# Altium project ARM_V2.PrjPcb (part 1 of 2)
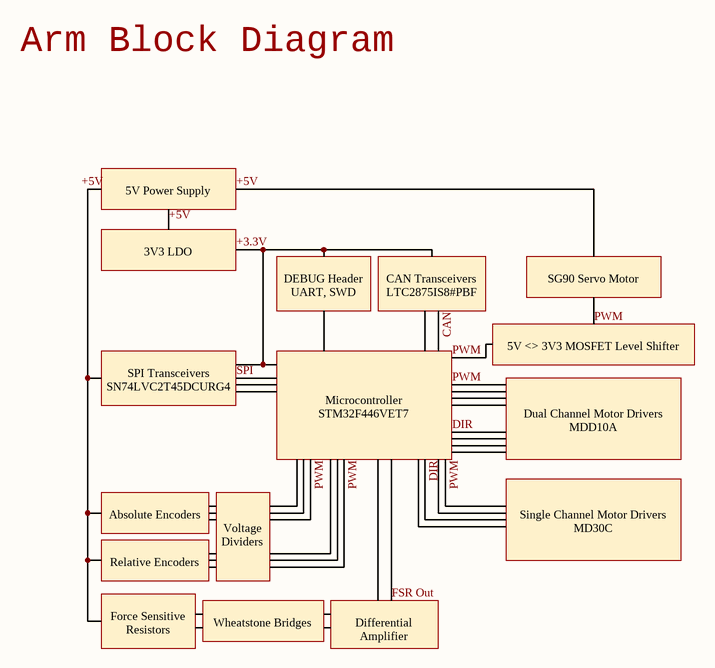
[diagram p0: Block Diagram.SchDoc]
BoardName: Arm_Rev2
9 sheets, 172 parts. Net scope: flat (ports and power ports of the same name join across sheets).
Board file: ARM_V2.PcbDoc
Sheets:
  Block Diagram.SchDoc
  CAN.SchDoc
  FSR.SchDoc
  Integrated Connectors.SchDoc
  MCU.SchDoc
  POWER.SchDoc
  SPI Encoders.SchDoc
  Support.SchDoc
  Servo and Encoders.SchDoc

## Sheet Block Diagram.SchDoc: Arm - Block Diagram
size Letter; DrawnBy: K.Hong; Organization: UW Robotics; Address1: 200 University Avenue; Address2: Waterloo; Address3: Ontario; Address4: Canada N2L 3G6; SheetNumber: 1; SheetTotal: 9

### Notes on the sheet
- Arm Block Diagram
- 5V Power Supply
- 3V3 LDO
- DEBUG Header
  UART, SWD
- CAN Transceivers
  LTC2875IS8#PBF
- 5V <> 3V3 MOSFET Level Shifter
- SG90 Servo Motor
- SPI Transceivers
  SN74LVC2T45DCURG4
- Microcontroller
  STM32F446VET7
- Dual Channel Motor Drivers
  MDD10A
- Absolute Encoders
- Single Channel Motor Drivers
  MD30C
- Relative Encoders
- Voltage Dividers
- Force Sensitive Resistors
- Wheatstone Bridges
- Differential
  Amplifier
- Labels drawn without touching a wire or pin: +5V
- Title
- Size:
- Date:
- Letter
- Drawn By:
- Sheet
- of
- File:

## Sheet CAN.SchDoc: Arm - CAN Transcievers
size Letter; DrawnBy: P.Onaifo, K.Hong; Organization: UW Robotics; Address1: 200 University Avenue; Address2: Waterloo; Address3: Ontario; Address4: Canada N2L 3G6; SheetNumber: 2; SheetTotal: 9
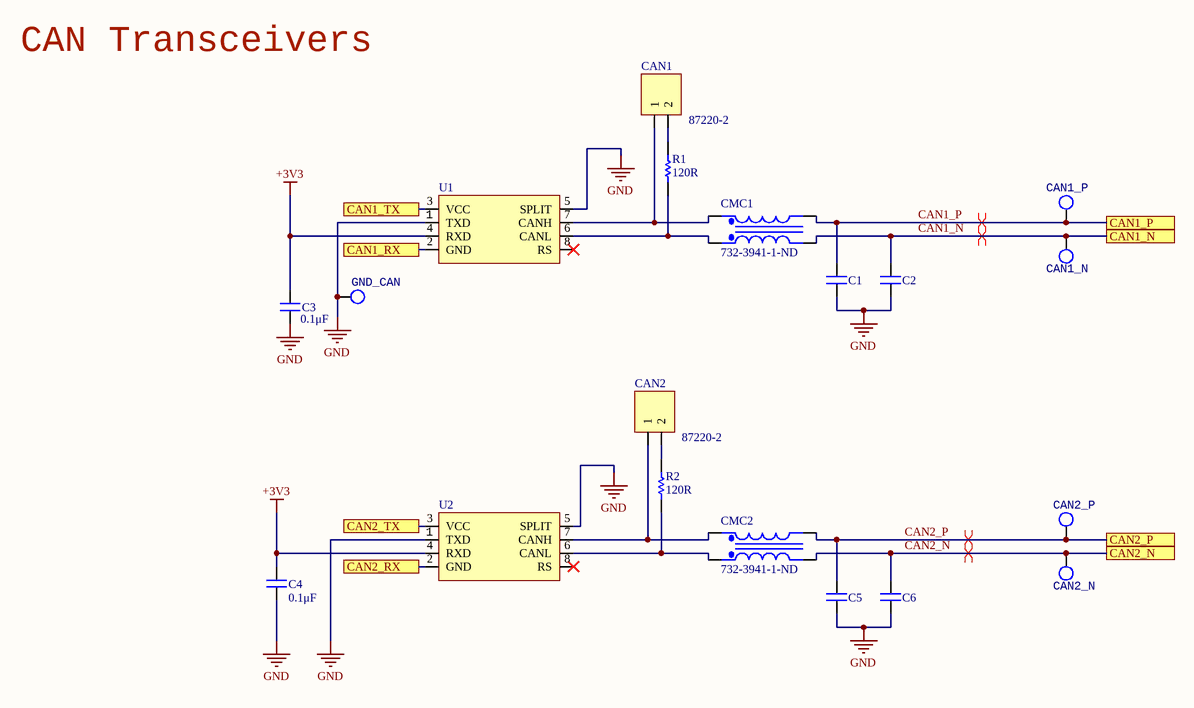
[diagram p1: CAN.SchDoc]

### Parts
C1  CAP_33pF_50V_0603  [CAPC0603(1608)55_N]  (value not drawn)
C2  CAP_33pF_50V_0603  [CAPC0603(1608)55_N]  (value not drawn)
C3  value 0.1μF  [CAPC0603(1608)55_N]  (hidden comment: CAP_0.1uF_50V_0603)
C4  value 0.1μF  [CAPC0603(1608)55_N]  (hidden comment: CAP_0.1uF_50V_0603)
C5  CAP_33pF_50V_0603  [CAPC0603(1608)55_N]  (value not drawn)
C6  CAP_33pF_50V_0603  [CAPC0603(1608)55_N]  (value not drawn)
CAN1  Manufacturer Part Number 1: 87220-2  [HDR1X2]  (hidden comment: JUMPER_2)
CAN1_N  TESTPOINT_LOOP  [TESTPOINT_LOOP]  (value not drawn)
CAN1_P  TESTPOINT_LOOP  [TESTPOINT_LOOP]  (value not drawn)
CAN2  Manufacturer Part Number 1: 87220-2  [HDR1X2]  (hidden comment: JUMPER_2)
CAN2_N  TESTPOINT_LOOP  [TESTPOINT_LOOP]  (value not drawn)
CAN2_P  TESTPOINT_LOOP  [TESTPOINT_LOOP]  (value not drawn)
CMC1  Supplier Part Number 1: 732-3941-1-ND  [744212510]  (hidden comment: CMC_51uH)
CMC2  Supplier Part Number 1: 732-3941-1-ND  [744212510]  (hidden comment: CMC_51uH)
GND_CAN  TESTPOINT_LOOP  [TESTPOINT_LOOP]  (value not drawn)
R1  value 120R  [RESC0603(1608)_N]  (hidden comment: RES_120R_0603)
R2  value 120R  [RESC0603(1608)_N]  (hidden comment: RES_120R_0603)
U1  IC TXRX CAN  [LT-S8_N]  (value not drawn)
U2  IC TXRX CAN  [LT-S8_N]  (value not drawn)

### Ports
CAN1_N, CAN1_P, CAN1_RX, CAN1_TX, CAN2_N, CAN2_P, CAN2_RX, CAN2_TX

### Nets
+3V3: C3.2 C4.2 U1.4(RXD) U2.4(RXD)
GND: C1.1 C2.1 C3.1 C4.1 C5.1 C6.1 GND_CAN.1 U1.1(TXD) U1.5(SPLIT) U2.1(TXD) U2.5(SPLIT)
CAN1_N: C2.2 CAN1_N.1 CMC1.5(Pri-) ; port CAN1_N
CAN1_P: C1.2 CAN1_P.1 CMC1.4(Sec-) ; port CAN1_P
CAN2_N: C6.2 CAN2_N.1 CMC2.5(Pri-) ; port CAN2_N
CAN2_P: C5.2 CAN2_P.1 CMC2.4(Sec-) ; port CAN2_P
NetCAN1_1: CAN1.1 CMC1.3(Sec+) U1.7(CANH)
NetCAN1_2: CAN1.2 R1.2
NetCAN2_1: CAN2.1 CMC2.3(Sec+) U2.7(CANH)
NetCAN2_2: CAN2.2 R2.2
NetCMC1_1: CMC1.1(Pri+) R1.1 U1.6(CANL)
NetCMC2_1: CMC2.1(Pri+) R2.1 U2.6(CANL)
NetU1_2: U1.2(GND) ; port CAN1_RX
NetU1_3: U1.3(VCC) ; port CAN1_TX
NetU2_2: U2.2(GND) ; port CAN2_RX
NetU2_3: U2.3(VCC) ; port CAN2_TX

Not connected (* = marked no-connect by the designer): U1 8(RS)*; U2 8(RS)*

### Layout directives
differential pair: CAN1_N, CAN1_P, CAN2_N, CAN2_P

### Notes on the sheet
- CAN Transceivers
- Title
- Size:
- Date:
- Letter
- Drawn By:
- Sheet
- of
- File:

### Library data of the parts
C1 C2 C5 C6 = CAP_33pF_50V_0603: CAP CER 33PF 50V C0G/NP0; Manufacturer 1: Yageo; Manufacturer Part Number 1: CC0603JRNPO9BN330; Dielectric Material: Ceramic; Temperature Coefficient: 30ppm/°C; Tolerance: 5%; Dielectric: C0G, NP0; Insulation Resistance: 100GR; Supplier 1: Digi-Key; Stock 1: 177901; Pricing 1: 1=0.10000, 10=0.04900, 100=0.02190, 500=0.01566, 1000=0.01231 (USD); RoHS: Yes; Mount: Surface Mount; Number of Pins: 2; Case Code (Metric): 1608; Case Code (Imperial): 0603; Min Operating Temperature: -55°C; Max Operating Temperature: 125°C; Termination: SMD/SMT; Composition: Ceramic; Voltage: 50V; Packaging: Tape and Reel; Voltage Rating: 50V; Package Quantity: 1; Voltage Rating (DC): 50V; Length: 1.6mm; Height: 0.8mm; Thickness: 0.035inch; Depth: 0.8mm; Width: 0.031inch; Radiation Hardening: No; Lead Free: Lead Free; REACH SVHC: No SVHC; ComponentLink1URL: https://datasheet.ciiva.com/11786/0900766b8079c870-11786082.pdf?src-supplier=RSComponents; ComponentLink1Description: https://datasheet.ciiva.com/11786/0900766b8079c870-11786082.pdf?src-supplier=RSComponents; ComponentLink2URL: https://datasheet.ciiva.com/26862/getdatasheetpartid-403532-26862767.pdf?src-supplier=Verical; ComponentLink2Description: https://datasheet.ciiva.com/26862/getdatasheetpartid-403532-26862767.pdf?src-supplier=Verical; ComponentLink3URL: https://datasheet.ciiva.com/144/mlccorderingcode-144643.pdf?src-supplier=Digi-Key; ComponentLink3Description: https://datasheet.ciiva.com/144/mlccorderingcode-144643.pdf?src-supplier=Digi-Key; ComponentLink4URL: https://datasheet.ciiva.com/144/mlccorderingcode-144645.pdf?src-supplier=Digi-Key; ComponentLink4Description: https://datasheet.ciiva.com/144/mlccorderingcode-144645.pdf?src-supplier=Digi-Key; ComponentLink5URL: https://datasheet.ciiva.com/8033/1372269-8033734.pdf?src-supplier=Element14; ComponentLink5Description: https://datasheet.ciiva.com/8033/1372269-8033734.pdf?src-supplier=Element14; ComponentLink6URL: https://datasheet.ciiva.com/8033/1443161-8033735.pdf?src-supplier=Element14; ComponentLink6Description: https://datasheet.ciiva.com/8033/1443161-8033735.pdf?src-supplier=Element14; ComponentLink7URL: https://datasheet.ciiva.com/11464/upy-gp-np0-16v-to-50v-8-11464730.pdf?src-supplier=Avnet; ComponentLink7Description: https://datasheet.ciiva.com/11464/upy-gp-np0-16v-to-50v-8-11464730.pdf?src-supplier=Avnet; ComponentLink8URL: https://datasheet.ciiva.com/46430/1835847-46430155.pdf?src-supplier=Element14; ComponentLink8Description: https://datasheet.ciiva.com/46430/1835847-46430155.pdf?src-supplier=Element14; ComponentLink9URL: https://datasheet.ciiva.com/144/mlccorderingcode-144644.pdf?src-supplier=Digi-Key; ComponentLink9Description: https://datasheet.ciiva.com/144/mlccorderingcode-144644.pdf?src-supplier=Digi-Key; ComponentLink10URL: https://datasheet.ciiva.com/5426/upy-gp-np0-16v-to-50v-8-5426614.pdf?src-supplier=Mouser; ComponentLink10Description: https://datasheet.ciiva.com/5426/upy-gp-np0-16v-to-50v-8-5426614.pdf?src-supplier=Mouser; ComponentLink11URL: https://datasheet.ciiva.com/7978/1443161-7978142.pdf?src-supplier=Element14; ComponentLink11Description: https://datasheet.ciiva.com/7978/1443161-7978142.pdf?src-supplier=Element14; Supplier Part Number 1: 311-1064-1-ND; Value: 33pF; Package: 0603 (1608 Metric)
C3 C4 = CAP_0.1uF_50V_0603: CAP CER 0.1UF 50V X7R 0603; Manufacturer Part Number 1: CC0603KRX7R9BB104; Manufacturer 1: Yageo; Dimensions: 0.063" L x 0.031" W (1.60mm x 0.80mm); Package: 0603 (1608 Metric); Temperature Coefficient: X7R; Voltage Rating: 50V; Supplier Part Number 1: 311-1344-1-ND; Supplier 1: Digi-Key; Mount: Surface Mount; Case Code (Imperial): 0603; Case Code (Metric): 1608; Dielectric: X7R
CAN1 CAN2 = JUMPER_2: HEADER 2X1; Manufacturer 1: TE Connectivity; Supplier 1: Digi-Key; Supplier Part Number 1: A26542-ND; Mount: Through Hole
CAN1_N CAN1_P CAN2_N CAN2_P GND_CAN = TESTPOINT_LOOP: Loop testpoint through-hole pad; Manufacturer Part Number 1: 5002; Manufacturer 1: Keystone Electronics; Supplier Part Number 1: 36-5002-ND; Supplier 1: Digi-Key; Mount: Through Hole
CMC1 CMC2 = CMC_51uH: CMC 51uH 300MA 2LN SMD; Manufacturer 1: Wurth Electronics; Core Material: Ferrite; DC Resistance (DCR): 160mR; Test Frequency: 100kHz; Inductance Tolerance: 50%; Voltage Rating (DC): 80V; Number of Lines: 2; Impedance: 300R; Supplier 1: Digi-Key; Manufacturer Part Number 1: 744212510; Stock 1: 1070; Pricing 1: 1=4.22000, 10=4.16600, 50=3.76300, 100=3.62900, 500=3.36000 (USD); RoHS: Yes; Mount: Surface Mount; Case/Package: SMD/SMT; Number of Pins: 4; Min Operating Temperature: -40°C; Max Operating Temperature: 105°C; Current: 300mA; Max DC Current: 300mA; Termination: SMD/SMT; Current Rating: 300mA; Inductance: 51uH; Tolerance: 50%; Package Quantity: 1000; Packaging: Tape and Reel; Length: 6.5mm; Height: 1.65mm; Depth: 3.6mm; Width: 0.142inch; REACH SVHC: No SVHC; Lead Free: Lead Free; ComponentLink1URL: https://datasheet.ciiva.com/11800/0900766b8059564e-11800467.pdf?src-supplier=RSComponents; ComponentLink1Description: https://datasheet.ciiva.com/11800/0900766b8059564e-11800467.pdf?src-supplier=RSComponents; ComponentLink2URL: https://datasheet.ciiva.com/1130/744212510-1130407.pdf?src-supplier=Newark; ComponentLink2Description: https://datasheet.ciiva.com/1130/744212510-1130407.pdf?src-supplier=Newark; ComponentLink3URL: https://datasheet.ciiva.com/6048/1735560-6048484.pdf?src-supplier=Farnell; ComponentLink3Description: https://datasheet.ciiva.com/6048/1735560-6048484.pdf?src-supplier=Farnell; ComponentLink4URL: https://datasheet.ciiva.com/4952/744212510-77598-4952687.pdf?src-supplier=Mouser; ComponentLink4Description: https://datasheet.ciiva.com/4952/744212510-77598-4952687.pdf?src-supplier=Mouser; ComponentLink5URL: https://datasheet.ciiva.com/6216/744212510-6216346.pdf?src-supplier=Digi-Key; ComponentLink5Description: https://datasheet.ciiva.com/6216/744212510-6216346.pdf?src-supplier=Digi-Key; ComponentLink6URL: https://datasheet.ciiva.com/22705/1735560-22705131.pdf?src-supplier=Element14; ComponentLink6Description: https://datasheet.ciiva.com/22705/1735560-22705131.pdf?src-supplier=Element14; ComponentLink7URL: https://datasheet.ciiva.com/6216/744212510-6216348.pdf?src-supplier=Digi-Key; ComponentLink7Description: https://datasheet.ciiva.com/6216/744212510-6216348.pdf?src-supplier=Digi-Key; ComponentLink8URL: https://datasheet.ciiva.com/7764/1735560-7764951.pdf?src-supplier=Element14; ComponentLink8Description: https://datasheet.ciiva.com/7764/1735560-7764951.pdf?src-supplier=Element14
R1 R2 = RES_120R_0603: RES SMD 120 OHM 5% 1/10W 0603; Manufacturer: Yageo; MPN: RC0603JR-07120RL; Package: 0603 (1608 Metric); Dimensions: 0.063" L x 0.031" W (1.60mm x 0.80mm); Tolerance: 5%; Supplier Part Number 1: 311-120GRCT-ND; Supplier 1: Digi-Key
U1 U2 = LTC2875: IC TXRX CAN 4MBPS 8SO; Manufacturer 1: Linear Technologies; Manufacturer Part Number 1: LTC2875IS8#PBF; Package: 8-SOIC (0.154", 3.90mm Width); ComponentLink1Description: Datasheet; ComponentLink1URL: https://www.analog.com/media/en/technical-documentation/data-sheets/2875f.pdf; Supplier Part Number 1: LTC2875IS8#PBF-ND; Supplier 1: Digi-Key; Mount: Surface Mount

## Sheet FSR.SchDoc: Arm - Claw Sensor
size Letter; DrawnBy: N. Chapman, A. Ebrahim, K.Hong; Organization: UW Robotics; Address1: 200 University Avenue; Address2: Waterloo; Address3: Ontario; Address4: Canada N2L 3G6; SheetNumber: 7; SheetTotal: 9
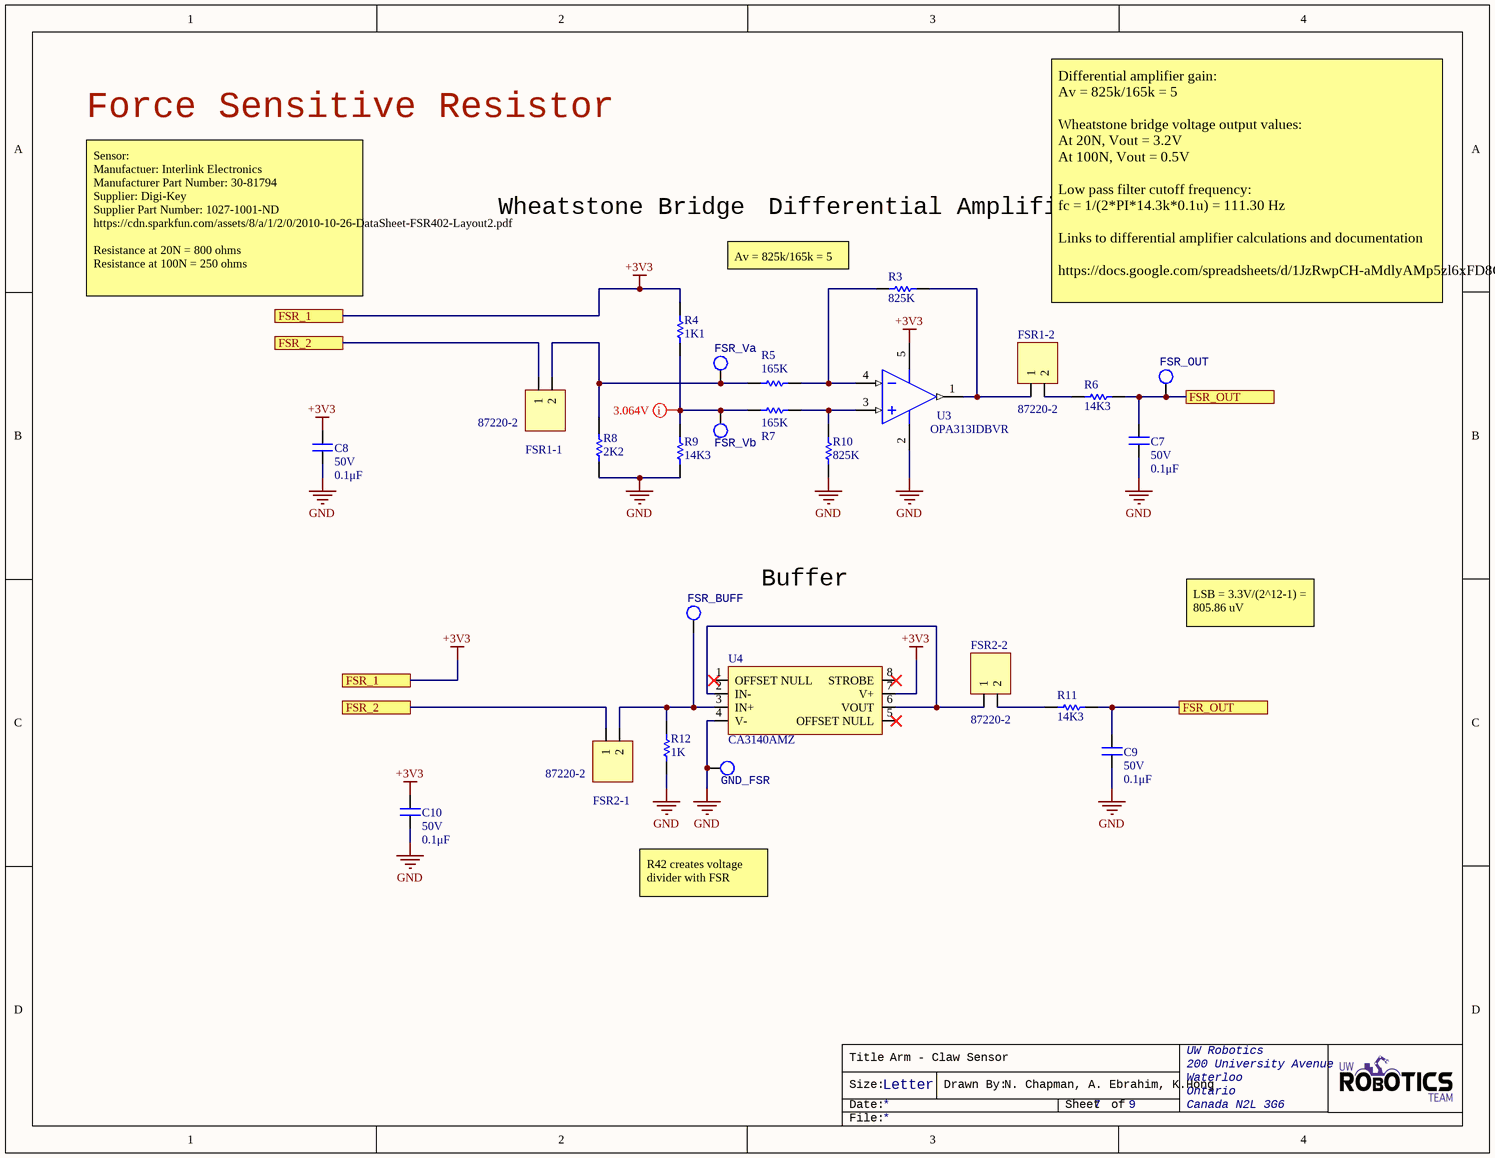
[diagram p2: FSR.SchDoc]

### Parts
C7  value 0.1μF  Voltage Rating: 50V  [CAPC0603(1608)55_N]  (hidden comment: CAP_0.1uF_50V_0603)
C8  value 0.1μF  Voltage Rating: 50V  [CAPC0603(1608)55_N]  (hidden comment: CAP_0.1uF_50V_0603)
C9  value 0.1μF  Voltage Rating: 50V  [CAPC0603(1608)55_N]  (hidden comment: CAP_0.1uF_50V_0603)
C10  value 0.1μF  Voltage Rating: 50V  [CAPC0603(1608)55_N]  (hidden comment: CAP_0.1uF_50V_0603)
FSR1-1  Manufacturer Part Number 1: 87220-2  [HDR1X2]  (hidden comment: JUMPER_2)
FSR1-2  Manufacturer Part Number 1: 87220-2  [HDR1X2]  (hidden comment: JUMPER_2)
FSR2-1  Manufacturer Part Number 1: 87220-2  [HDR1X2]  (hidden comment: JUMPER_2)
FSR2-2  Manufacturer Part Number 1: 87220-2  [HDR1X2]  (hidden comment: JUMPER_2)
FSR_BUFF  TESTPOINT_LOOP  [TESTPOINT_LOOP]  (value not drawn)
FSR_OUT  TESTPOINT_LOOP  [TESTPOINT_LOOP]  (value not drawn)
FSR_Va  TESTPOINT_LOOP  [TESTPOINT_LOOP]  (value not drawn)
FSR_Vb  TESTPOINT_LOOP  [TESTPOINT_LOOP]  (value not drawn)
GND_FSR  TESTPOINT_LOOP  [TESTPOINT_LOOP]  (value not drawn)
R3  value 825K  [RESC0603(1608)_N]  (hidden comment: RES_825K_0603)
R4  value 1K1  [RESC0603(1608)_N]  (hidden comment: 1.1K 1%)
R5  value 165K  [RESC0603(1608)_N]  (hidden comment: RES_165K_0603)
R6  value 14K3  [RESC0603(1608)_N]  (hidden comment: RES_14K3_0603)
R7  value 165K  [RESC0603(1608)_N]  (hidden comment: RES_165K_0603)
R8  value 2K2  [RESC0603(1608)_N]  (hidden comment: RES_2K2_0603)
R9  value 14K3  [RESC0603(1608)_N]  (hidden comment: 14.3K 1%)
R10  value 825K  [RESC0603(1608)_N]  (hidden comment: RES_825K_0603)
R11  value 14K3  [RESC0603(1608)_N]  (hidden comment: RES_14K3_0603)
R12  value 1K  [RESC0603(1608)_N]  (hidden comment: RES_1K_0603)
U3  OPA313IDBVR  [DBV0005A_M]
U4  CA3140AMZ  [CA3140AMZ]

### Ports
FSR_1, FSR_2, FSR_OUT

### Nets
+3V3: C8.2 C10.2 R4.2 U3.5(V+) U4.7(V+) ; port FSR_1
GND: C7.1 C8.1 C9.1 C10.1 GND_FSR.1 R8.1 R9.1 R10.1 R12.1 U3.2(V-) U4.4(V-)
NetC7_2: C7.2 C9.2 FSR_OUT.1 R6.2 R11.2 ; port FSR_OUT
NetFSR1-1_1: FSR1-1.1 FSR2-1.1 ; port FSR_2
NetFSR1-1_2: FSR1-1.2 FSR_Va.1 R5.1 R8.2
NetFSR1-2_1: FSR1-2.1 R3.2 U3.1(OUT)
NetFSR1-2_2: FSR1-2.2 R6.1
NetFSR2-1_2: FSR2-1.2 FSR_BUFF.1 R12.2 U4.3(IN+)
NetFSR2-2_1: FSR2-2.1 U4.2(IN-) U4.6(VOUT)
NetFSR2-2_2: FSR2-2.2 R11.1
NetFSR_Vb_1: FSR_Vb.1 R4.1 R7.1 R9.2
NetR3_1: R3.1 R5.2 U3.4(IN-)
NetR7_2: R7.2 R10.2 U3.3(IN+)

Not connected (* = marked no-connect by the designer): U4 1(OFFSET_NULL)* 5(OFFSET_NULL)* 8(STROBE)*

### Layout directives
mark named 3.064V: NetFSR_Vb_1

### Notes on the sheet
- Force Sensitive Resistor
- Wheatstone Bridge
- Differential Amplifier
- Sensor:
  Manufactuer: Interlink Electronics
  Manufacturer Part Number: 30-81794
  Supplier: Digi-Key
  Supplier Part Number: 1027-1001-ND
  https://cdn.sparkfun.com/assets/8/a/1/2/0/2010-10-26-DataSheet-FSR402-Layout2.pdf
  Resistance at 20N = 800 ohms
  Resistance at 100N = 250 ohms
- Av = 825k/165k = 5
- Differential amplifier gain:
  Av = 825k/165k = 5
  Wheatstone bridge voltage output values:
  At 20N, Vout = 3.2V
  At 100N, Vout = 0.5V
  Low pass filter cutoff frequency:
  fc = 1/(2*PI*14.3k*0.1u) = 111.30 Hz
  Links to differential amplifier calculations and documentation
  https://docs.google.com/spreadsheets/d/1JzRwpCH-aMdlyAMp5zl6xFD8GIuJzvmOR8Y5Kzd1RN0/edit#gid=0
- Buffer
- LSB = 3.3V/(2^12-1) = 805.86 uV
- R42 creates voltage divider with FSR
- Title
- Size:
- Date:
- Letter
- Drawn By:
- Sheet
- of
- File:

### Library data of the parts
C7-C10 = CAP_0.1uF_50V_0603: as C3 on sheet CAN; Dimensions: 0.063" L x 0.031" W (1.60mm x 0.80mm); Package: 0603 (1608 Metric); Temperature Coefficient: X7R; Supplier Part Number 1: 311-1344-1-ND; Supplier 1: Digi-Key; Mount: Surface Mount; Case Code (Imperial): 0603; Case Code (Metric): 1608; Dielectric: X7R
FSR1-1 FSR1-2 FSR2-1 FSR2-2 = JUMPER_2: as CAN1 on sheet CAN; Supplier 1: Digi-Key; Supplier Part Number 1: A26542-ND; Mount: Through Hole
FSR_BUFF FSR_OUT FSR_Va FSR_Vb GND_FSR = TESTPOINT_LOOP: as CAN1_N on sheet CAN; Supplier Part Number 1: 36-5002-ND; Supplier 1: Digi-Key; Mount: Through Hole
R3 R10 = RES_825K_0603: RES SMD 825K OHM 1% 1/10W 0603; Manufacturer: Yageo; MPN: RC0603FR-07825KL; Package: 0603 (1608 Metric); Dimensions: 0.063" L x 0.031" W (1.60mm x 0.80mm); Tolerance: 1%; Supplier Part Number 1: 311-825KHRCT-ND; Supplier 1: Digi-Key
R4 = RES_1K1_0603: RES SMD 1.1K OHM 1% 1/10W 0603; Manufacturer: Yageo; MPN: RC0603FR-071K1L; Dimensions: 0.063" L x 0.031" W (1.60mm x 0.80mm); Tolerance: 1%; Package: 0603 (1608 Metric); Supplier Part Number 1: 311-1.10KHRCT-ND; Supplier 1: Digi-Key
R5 R7 = RES_165K_0603: RES SMD 165K OHM 1% 1/10W 0603; Manufacturer: Yageo; MPN: RC0603FR-07165KL; Package: 0603 (1608 Metric); Dimensions: 0.063" L x 0.031" W (1.60mm x 0.80mm); Tolerance: 1%; Supplier Part Number 1: 311-165KHRCT-ND; Supplier 1: Digi-Key
R6 R9 R11 = RES_14K3_0603: RES SMD 14.3K OHM 1% 1/10W 0603; Manufacturer: Yageo; MPN: RC0603FR-0714K3L; Package: 0603 (1608 Metric); Dimensions: 0.063" L x 0.031" W (1.60mm x 0.80mm); Tolerance: 1%; Supplier Part Number 1: 311-14.3KHRCT-ND; Supplier 1: Digi-Key
R8 = RES_2K2_0603: RES SMD 2.2K OHM 1% 1/10W 0603; Manufacturer: Yageo; MPN: RC0603FR-072K2L; Dimensions: 0.063" L x 0.031" W (1.60mm x 0.80mm); Package: 0603 (1608 Metric); Tolerance: 1%; Supplier Part Number 1: 311-2.20KHRCT-ND; Supplier 1: Digi-Key
R12 = RES_1K_0603: RES SMD 1K OHM 5% 1/10W 0603; Manufacturer: Yageo; MPN: RC0603JR-071KL; Dimensions: 0.063" L x 0.031" W (1.60mm x 0.80mm); Tolerance: 5%; Package: 0603 (1608 Metric); Supplier Part Number 1: 311-1.0KGRCT-ND; Supplier 1: Digi-Key
U3 = OPAMP: IC OPAMP GP 1 CIRCUIT SOT23-5; Manufacturer 1: Texas Instruments; Offset Drift(Typ)(uV/C): 2; Rating: Catalog; Packing: LARGE T&R; SubFamily: Low Input Bias Current Amp (<=10pA), Low Power Amp (<=500uA); Number of Channels: 1; Eco-Plan: Green (RoHS & no Sb/Br); Vio (25C)(Max)(mV): 2.5; Total Supply Voltage(Min)(+5V is 5, +/-5V is 10): 1.8; CMRR(Min)(dB): 70; Total Supply Voltage(Max)(+5V is 5, +/-5V is 10): 5.5; Iq per channel(Max)(mA): 0.06; Slew Rate(Typ)(V/us): 0.5; ComponentLink1Description: Manufacturer URL; PackageVersion: 4073253-4/K, 03/2006; ComponentLink2Description: Datasheet; Code_JEDEC: MO-178; GBW(Typ)(MHz): 1; ComponentLink3Description: Package Specification; PartNumber: OPA313IDBVR; PackageReference: DBV0005A; PackageDescription: 5-Pin Plastic Small Outline, Body 1.6 x 2.9 mm, Pitch 0.95 mm; ComponentLink1URL: http://www.ti.com/; DatasheetVersion: SBOS649C; ComponentLink2URL: http://www.ti.com/lit/ds/symlink/opa313.pdf; ComponentLink3URL: http://www.ti.com/litv/pdf/mpds018i; Supplier Part Number 1: 296-35607-1-ND; Supplier 1: Digi-Key; Mount: Surface Mount; Manufacturer Part Number 1: OPA313IDBVR
U4 = CA3140AMZ: IC OPAMP GP 1 CIRCUIT 8SOIC; Manufacturer 1: Renesas Electronics America Inc.; Supplier Part Number 1: CA3140AMZ-ND; Supplier 1: Digi-Key; Manufacturer Part Number 1: CA3140AMZ; Mount: Surface Mount

## Sheet Integrated Connectors.SchDoc
size Letter
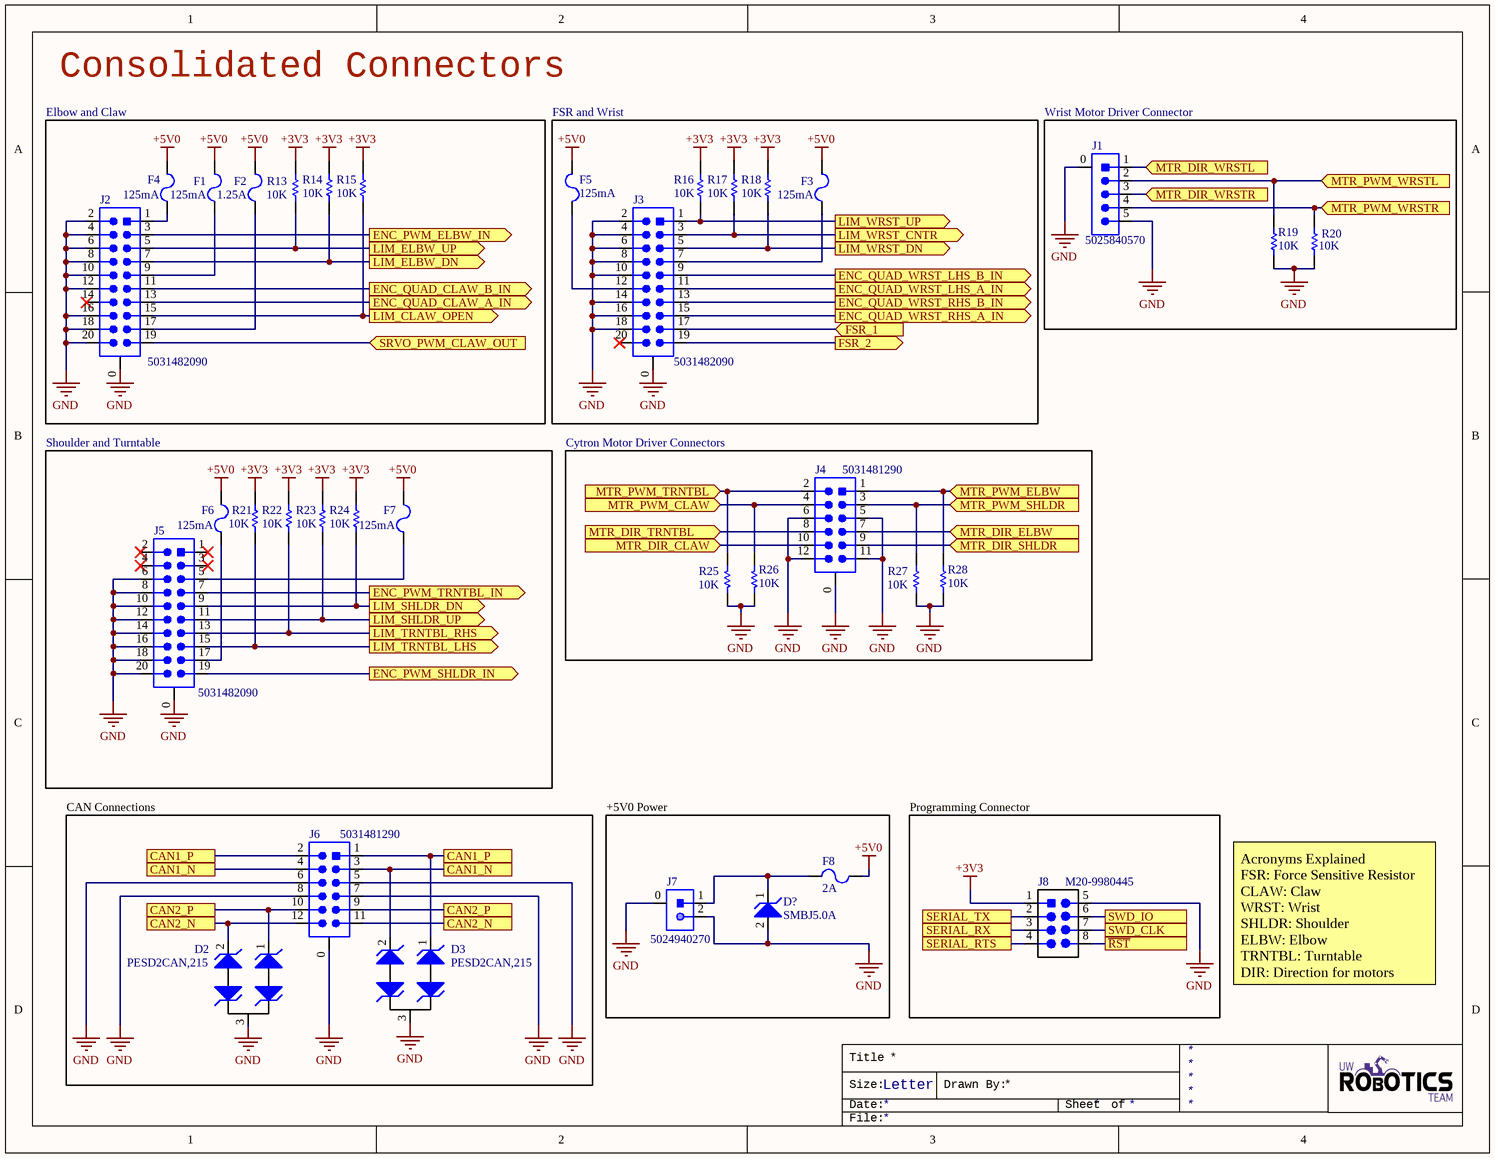
[diagram p3: Integrated Connectors.SchDoc]

### Parts
D2  Manufacturer Part Number 1: PESD2CAN,215  [TVS_DIODE_CAN]  (hidden comment: TVS_DIODE_CAN)
D3  Manufacturer Part Number 1: PESD2CAN,215  [TVS_DIODE_CAN]  (hidden comment: TVS_DIODE_CAN)
D?  Manufacturer Part Number 1: SMBJ5.0A  [TVS_DIODE_BIDIRECTIONAL]  (hidden comment: TVS_DIODE_UNIDIR_5V)
F1  Current Rating: 125mA  [FUSE_1206]  (hidden comment: FUSE_125mA_1206)
F2  Current Rating: 1.25A  [FUSE_1206]  (hidden comment: FUSE_1.25A_1206)
F3  Current Rating: 125mA  [FUSE_1206]  (hidden comment: FUSE_125mA_1206)
F4  Current Rating: 125mA  [FUSE_1206]  (hidden comment: FUSE_125mA_1206)
F5  Current Rating: 125mA  [FUSE_1206]  (hidden comment: FUSE_125mA_1206)
F6  Current Rating: 125mA  [FUSE_1206]  (hidden comment: FUSE_125mA_1206)
F7  Current Rating: 125mA  [FUSE_1206]  (hidden comment: FUSE_125mA_1206)
F8  Current Rating: 2A  [FUSE_1206]  (hidden comment: FUSE_2A_1206)
J1  Manufacturer Part Number 1: 5025840570  [MOLEX-5025840570]  (hidden comment: CON_5M_SM_VT)
J2  Manufacturer Part Number 1: 5031482090  [MOLEX-5031482090]  (hidden comment: CON_10x2M_SM_RA)
J3  Manufacturer Part Number 1: 5031482090  [MOLEX-5031482090]  (hidden comment: CON_10x2M_SM_RA)
J4  Manufacturer Part Number 1: 5031481290  [MOLEX-5031481290]  (hidden comment: CON_6x2M_SM_RA)
J5  Manufacturer Part Number 1: 5031482090  [MOLEX-5031482090]  (hidden comment: CON_10x2M_SM_RA)
J6  Manufacturer Part Number 1: 5031481290  [MOLEX-5031481290]  (hidden comment: CON_6x2M_SM_RA)
J7  Manufacturer Part Number 1: 5024940270  [MOLEX-5024940270]  (hidden comment: CON_2M_SM_RA)
J8  Manufacturer Part Number 1: M20-9980445  [HEADER_2X4]  (hidden comment: HEADER 4X2)
R13  value 10K  [RESC0603(1608)_N]  (hidden comment: RES_10K_0603)
R14  value 10K  [RESC0603(1608)_N]  (hidden comment: RES_10K_0603)
R15  value 10K  [RESC0603(1608)_N]  (hidden comment: RES_10K_0603)
R16  value 10K  [RESC0603(1608)_N]  (hidden comment: RES_10K_0603)
R17  value 10K  [RESC0603(1608)_N]  (hidden comment: RES_10K_0603)
R18  value 10K  [RESC0603(1608)_N]  (hidden comment: RES_10K_0603)
R19  value 10K  [RESC0603(1608)_N]  (hidden comment: RES_10K_0603)
R20  value 10K  [RESC0603(1608)_N]  (hidden comment: RES_10K_0603)
R21  value 10K  [RESC0603(1608)_N]  (hidden comment: RES_10K_0603)
R22  value 10K  [RESC0603(1608)_N]  (hidden comment: RES_10K_0603)
R23  value 10K  [RESC0603(1608)_N]  (hidden comment: RES_10K_0603)
R24  value 10K  [RESC0603(1608)_N]  (hidden comment: RES_10K_0603)
R25  value 10K  [RESC0603(1608)_N]  (hidden comment: RES_10K_0603)
R26  value 10K  [RESC0603(1608)_N]  (hidden comment: RES_10K_0603)
R27  value 10K  [RESC0603(1608)_N]  (hidden comment: RES_10K_0603)
R28  value 10K  [RESC0603(1608)_N]  (hidden comment: RES_10K_0603)

### Blocks framed on the sheet
Elbow and Claw: F1 F2 F4 J2 R13-R15
FSR and Wrist: F3 F5 J3 R16-R18
Wrist Motor Driver Connector: J1 R19 R20
Shoulder and Turntable: F6 F7 J5 R21-R24
Cytron Motor Driver Connectors: J4 R25-R28
CAN Connections: D2 D3 J6
+5V0 Power: D? F8 J7
Programming Connector: J8

### Ports
CAN1_N, CAN1_P, CAN2_N, CAN2_P, ENC_PWM_ELBW_IN (out), ENC_PWM_SHLDR_IN (out), ENC_PWM_TRNTBL_IN (out), ENC_QUAD_CLAW_A_IN (out), ENC_QUAD_CLAW_B_IN (out), ENC_QUAD_WRST_LHS_A_IN (out), ENC_QUAD_WRST_LHS_B_IN (out), ENC_QUAD_WRST_RHS_A_IN (out), ENC_QUAD_WRST_RHS_B_IN (out), FSR_1 (in), FSR_2 (out), LIM_CLAW_OPEN (out), LIM_ELBW_DN (out), LIM_ELBW_UP (out), LIM_SHLDR_DN (out), LIM_SHLDR_UP (out), LIM_TRNTBL_LHS (out), LIM_TRNTBL_RHS (out), LIM_WRST_CNTR (out), LIM_WRST_DN (out), LIM_WRST_UP (out), MTR_DIR_CLAW (in), MTR_DIR_ELBW (in), MTR_DIR_SHLDR (in), MTR_DIR_TRNTBL (in), MTR_DIR_WRSTL (in), MTR_DIR_WRSTR (in), MTR_PWM_CLAW (in), MTR_PWM_ELBW (in), MTR_PWM_SHLDR (in), MTR_PWM_TRNTBL (in), MTR_PWM_WRSTL (in), MTR_PWM_WRSTR (in), SERIAL_RTS, SERIAL_RX, SERIAL_TX, SRVO_PWM_CLAW_OUT (in), SWD_CLK, SWD_IO, ~{RST}

### Nets
+3V3: J3.17 J8.1(VCC) R13.2 R14.2 R15.2 R16.2 R17.2 R18.2 R21.2 R22.2 R23.2 R24.2 ; port FSR_1
+5V0: F1.2 F2.2 F3.2 F4.2 F5.2 F6.2 F7.2 F8.2
GND: D2.3 D3.3 D?.2 J1.0 J1.5 J2.0 J2.2 J2.4 J2.6 J2.8 J2.10 J2.12 J2.16 J2.18 J2.20 J3.0 J3.2 J3.4 J3.6 J3.8 J3.10 J3.14 J3.16 J3.18 J4.0 J4.5 J4.6 J4.11 J4.12 J5.0 J5.6 J5.8 J5.10 J5.12 J5.14 J5.16 J5.18 J5.20 J6.0 J6.5 J6.6 J6.7 J6.8 J7.0 J7.2 J8.5(GND) R19.1 R20.1 R25.1 R26.1 R27.1 R28.1
CAN1_N: D3.2 J6.3 J6.4 ; port CAN1_N
CAN1_P: D3.1 J6.1 J6.2 ; port CAN1_P
CAN2_N: D2.2 J6.11 J6.12 ; port CAN2_N
CAN2_P: D2.1 J6.9 J6.10 ; port CAN2_P
NetC24_2: J8.8 ; port ~{RST}
NetD?_1: D?.1 F8.1 J7.1
NetF1_1: F1.1 J2.9
NetF2_1: F2.1 J2.17
NetF3_1: F3.1 J3.7
NetF4_1: F4.1 J2.1
NetF5_1: F5.1 J3.12
NetF6_1: F6.1 J5.17
NetF7_1: F7.1 J5.5
NetFSR1-1_1: J3.19 ; port FSR_2
NetJ1_1: J1.1 ; port MTR_DIR_WRSTL
NetJ1_2: J1.2 R19.2 ; port MTR_PWM_WRSTL
NetJ1_3: J1.3 ; port MTR_DIR_WRSTR
NetJ1_4: J1.4 R20.2 ; port MTR_PWM_WRSTR
NetJ2_3: J2.3 ; port ENC_PWM_ELBW_IN
NetJ2_5: J2.5 R13.1 ; port LIM_ELBW_UP
NetJ2_7: J2.7 R14.1 ; port LIM_ELBW_DN
NetJ2_11: J2.11 ; port ENC_QUAD_CLAW_B_IN
NetJ2_13: J2.13 ; port ENC_QUAD_CLAW_A_IN
NetJ2_15: J2.15 R15.1 ; port LIM_CLAW_OPEN
NetJ2_19: J2.19 ; port SRVO_PWM_CLAW_OUT
NetJ3_1: J3.1 R16.1 ; port LIM_WRST_UP
NetJ3_3: J3.3 R17.1 ; port LIM_WRST_CNTR
NetJ3_5: J3.5 R18.1 ; port LIM_WRST_DN
NetJ3_9: J3.9 ; port ENC_QUAD_WRST_LHS_B_IN
NetJ3_11: J3.11 ; port ENC_QUAD_WRST_LHS_A_IN
NetJ3_13: J3.13 ; port ENC_QUAD_WRST_RHS_B_IN
NetJ3_15: J3.15 ; port ENC_QUAD_WRST_RHS_A_IN
NetJ4_1: J4.1 R28.2 ; port MTR_PWM_ELBW
NetJ4_2: J4.2 R25.2 ; port MTR_PWM_TRNTBL
NetJ4_3: J4.3 R27.2 ; port MTR_PWM_SHLDR
NetJ4_4: J4.4 R26.2 ; port MTR_PWM_CLAW
NetJ4_7: J4.7 ; port MTR_DIR_ELBW
NetJ4_8: J4.8 ; port MTR_DIR_TRNTBL
NetJ4_9: J4.9 ; port MTR_DIR_SHLDR
NetJ4_10: J4.10 ; port MTR_DIR_CLAW
NetJ5_7: J5.7 ; port ENC_PWM_TRNTBL_IN
NetJ5_9: J5.9 R24.1 ; port LIM_SHLDR_DN
NetJ5_11: J5.11 R23.1 ; port LIM_SHLDR_UP
NetJ5_13: J5.13 R22.1 ; port LIM_TRNTBL_RHS
NetJ5_15: J5.15 R21.1 ; port LIM_TRNTBL_LHS
NetJ5_19: J5.19 ; port ENC_PWM_SHLDR_IN
NetJ8_2: J8.2 ; port SERIAL_TX
NetJ8_3: J8.3 ; port SERIAL_RX
NetJ8_4: J8.4 ; port SERIAL_RTS
NetJ8_6: J8.6 ; port SWD_IO
NetJ8_7: J8.7 ; port SWD_CLK

Not connected (* = marked no-connect by the designer): J2 14*; J3 20*; J5 1* 2* 3* 4*

### Notes on the sheet
- Consolidated Connectors
- Acronyms Explained
  FSR: Force Sensitive Resistor
  CLAW: Claw
  WRST: Wrist
  SHLDR: Shoulder
  ELBW: Elbow
  TRNTBL: Turntable
  DIR: Direction for motors
- Title
- Size:
- Date:
- Letter
- Drawn By:
- Sheet
- of
- File:

### Library data of the parts
D2 D3 = TVS_DIODE_CAN: TVS DIODE 24V 41V SOT323-3; Manufacturer 1: Nexperia USA Inc.; Package: SC-70, SOT-323; ComponentLink1Description: Datasheet; ComponentLink1URL: https://assets.nexperia.com/documents/data-sheet/PESD1CAN-U.pdf; Supplier Part Number 1: 1727-3891-1-ND; Supplier 1: Digi-Key; Mount: Surface Mount
D? = TVS_DIODE_UNIDIR_5V: TVS DIODE 5V 9.2V DO214AA; Manufacturer 1: Littelfuse; Max Power Dissipation: 600W; Polarity: Unidirectional; Number of Elements: 1; Leakage Current: 800uA; Reverse Breakdown Voltage: 6.4V; Max Surge Current: 65.3A; Max Breakdown Voltage: 7V; Test Current: 10mA; Element Configuration: Single; Power Line Protection: No; Current: 68A; ESD Protection: Yes; ComponentLink1Description: Datasheet; ComponentLink1URL: https://www.littelfuse.com/~/media/electronics/datasheets/tvs_diodes/littelfuse_tvs_diode_smbj_datasheet.pdf.pdf; Supplier 1: Digi-Key; Stock 1: 14825; Pricing 1: 1=0.41000, 10=0.30500, 25=0.27520, 100=0.14500, 250=0.14352, 500=0.12850, 1000=0.10000 (USD); RoHS: Yes; Mount: Surface Mount; Case/Package: SMB; Number of Pins: 2; Min Operating Temperature: -55°C; Max Operating Temperature: 150°C; Packaging: Tape and Reel; Package Quantity: 3000; Power Dissipation: 600W; Direction: Unidirectional; Reverse Standoff Voltage: 5V; Min Breakdown Voltage: 6.4V; Clamping Voltage: 9.2V; Peak Pulse Power: 600W; Breakdown Voltage: 6.4V; Termination: SMD/SMT; Peak Pulse Current: 65.3A; Number of Channels: 1; Max Reverse Leakage Current: 800uA; Operating Supply Voltage: 5V; Number of Unidirectional Channels: 1; Composition: Zener; Voltage Rating (DC): 5V; Voltage: 5V; Length: 0.179inch; Height: 0.096inch; Width: 0.155inch; Radiation Hardening: No; REACH SVHC: Unknown; Lead Free: Lead Free; ComponentLink2URL: https://datasheet.ciiva.com/25624/0900766b810f4eeb-25624712.pdf?src-supplier=RSComponents; ComponentLink2Description: https://datasheet.ciiva.com/25624/0900766b810f4eeb-25624712.pdf?src-supplier=RSComponents; ComponentLink3URL: https://datasheet.ciiva.com/34302/1546929-34302459.pdf?src-supplier=Jameco; ComponentLink3Description: https://datasheet.ciiva.com/34302/1546929-34302459.pdf?src-supplier=Jameco; ComponentLink4URL: https://datasheet.ciiva.com/46381/1677318-46381958.pdf?src-supplier=Element14; ComponentLink4Description: https://datasheet.ciiva.com/46381/1677318-46381958.pdf?src-supplier=Element14; ComponentLink5URL: https://datasheet.ciiva.com/331/littelfuse-tvs-diode-smbj-datasheet-pdf-331131.pdf?src-supplier=Digi-Key; ComponentLink5Description: https://datasheet.ciiva.com/331/littelfuse-tvs-diode-smbj-datasheet-pdf-331131.pdf?src-supplier=Digi-Key; ComponentLink6URL: https://datasheet.ciiva.com/331/littelfuse-tvs-diode-smbj-datasheet-pdf-331132.pdf?src-supplier=Digi-Key; ComponentLink6Description: https://datasheet.ciiva.com/331/littelfuse-tvs-diode-smbj-datasheet-pdf-331132.pdf?src-supplier=Digi-Key; ComponentLink7URL: https://datasheet.ciiva.com/331/littelfuse-tvs-diode-smbj-datasheet-pdf-331133.pdf?src-supplier=Digi-Key; ComponentLink7Description: https://datasheet.ciiva.com/331/littelfuse-tvs-diode-smbj-datasheet-pdf-331133.pdf?src-supplier=Digi-Key; Supplier Part Number 1: SMBJ5.0ALFCT-ND
F1 F3-F7 = FUSE_125mA_1206: FUSE SMD 125mA 125V; Manufacturer 1: Littelfuse; Manufacturer Part Number 1: 0466.125NRHF; DC Cold Resistance: 4R; Fuse Type: Board Mount (Cartridge Style Excluded); Power Dissipation: 69.1mW; Approvals: UL,CSA; ComponentLink1URL: https://datasheet.ciiva.com/303/littelfuse-fuse-466-303205.pdf?src-supplier=Digi-Key; ComponentLink1Description: https://datasheet.ciiva.com/303/littelfuse-fuse-466-303205.pdf?src-supplier=Digi-Key; Voltage Rating (AC): 125V; Voltage Rating (DC): 125V; Supplier 1: Digi-Key; Supplier Part Number 1: F6016CT-ND; Mount: Surface Mount; Stock 1: 10036; Pricing 1: 1=0.84000, 5=0.81200, 10=0.78700, 50=0.66180, 100=0.54930, 250=0.49940, 500=0.42450, 1000=0.37455 (USD); RoHS: Yes; Case/Package: 1206; Case Code (Metric): 3216; Case Code (Imperial): 1206; Housing Material: Ceramic; Min Operating Temperature: -55°C; Max Operating Temperature: 90°C; Packaging: Tape and Reel; Working Voltage: 125V; Package Quantity: 5000; Length: 3.18mm; Height: 0.023inch; Depth: 1.52mm; Width: 0.06inch; Lead Free: Lead Free
F2 = FUSE_1.25A_1206: FUSE SMD 1.25A 63V; Manufacturer 1: Littelfuse; Manufacturer Part Number 1: 04661.25NRHF; DC Cold Resistance: 59mR; Fuse Type: Board Mount (Cartridge Style Excluded); Approvals: UL,CSA; ComponentLink1URL: https://www.littelfuse.com/~/media/electronics/datasheets/fuses/littelfuse_fuse_466_datasheet.pdf.pdf?src-supplier=Digi-Key; ComponentLink1Description: https://www.littelfuse.com/~/media/electronics/datasheets/fuses/littelfuse_fuse_466_datasheet.pdf.pdf?src-supplier=Digi-Key; Voltage Rating (AC): 63V; Voltage Rating (DC): 63V; Supplier 1: Digi-Key; Supplier Part Number 1: F11418CT-ND; Mount: Surface Mount; Stock 1: 5020; Pricing 1: 1=0.84000, 5=0.81200, 10=0.78700, 50=0.66180, 100=0.54930, 250=0.49940, 500=0.42450, 1000=0.37455 (USD); RoHS: No; Case/Package: 1206; Case Code (Metric): 3216; Case Code (Imperial): 1206; Min Operating Temperature: -55°C; Max Operating Temperature: 90°C; Packaging: Tape and Reel
F8 = FUSE_2A_1206: FUSE SMD 2A 63V; Manufacturer Part Number 1: 0466002.NRHF; Manufacturer 1: Littelfuse; Fuse Type: Board Mount (Cartridge Style Excluded); DC Cold Resistance: 31mR; Power Dissipation: 157.5mW; Approvals: UL,CSA; ComponentLink1URL: https://datasheet.ciiva.com/7444/littelfuse-fuse-466-7444359.pdf?src-supplier=Digi-Key; ComponentLink1Description: https://datasheet.ciiva.com/7444/littelfuse-fuse-466-7444359.pdf?src-supplier=Digi-Key; ComponentLink2URL: https://datasheet.ciiva.com/7444/littelfuse-fuse-466-7444363.pdf?src-supplier=Digi-Key; ComponentLink2Description: https://datasheet.ciiva.com/7444/littelfuse-fuse-466-7444363.pdf?src-supplier=Digi-Key; ComponentLink3URL: https://datasheet.ciiva.com/7444/littelfuse-fuse-466-7444350.pdf?src-supplier=Digi-Key; ComponentLink3Description: https://datasheet.ciiva.com/7444/littelfuse-fuse-466-7444350.pdf?src-supplier=Digi-Key; Mount: Surface Mount; Voltage Rating (AC): 63V; Voltage Rating (DC): 63V; Supplier 1: Digi-Key; Supplier Part Number 1: F5696CT-ND; Stock 1: 8989; Pricing 1: 1=0.84000, 5=0.81200, 10=0.78700, 50=0.66180, 100=0.54930, 250=0.49940, 500=0.42450, 1000=0.37455 (USD); RoHS: Yes; Case/Package: 1206; Case Code (Imperial): 1206; Case Code (Metric): 3216; Housing Material: Ceramic; Min Operating Temperature: -55°C; Max Operating Temperature: 90°C; Package Quantity: 5000; Packaging: Tape and Reel; Current: 2A; Length: 3.18mm; Height: 0.023inch; Width: 0.06inch; Depth: 1.52mm
J1 = CON_5M_SM_VT: CONN HEADER SMD VERTICAL 1.5MM PITCH; Manufacturer 1: Molex; Connector Type: Receptacle,Center Strip Contact; Number of Positions: 5; Gender: Female; Current Rating: 2A; Voltage Rating: 100V; Glow Wire Compliant: Non-compliant; Supplier 1: Digi-Key; Stock 1: 2875; Pricing 1: 1=0.66000, 10=0.61400, 100=0.47110 (USD); RoHS: Yes; Mount: Surface Mount; Housing Material: Resin; Housing Color: Beige; Contact Plating: Tin; Color: Beige; Contact Material: Copper Alloy; Min Operating Temperature: -25°C; Max Operating Temperature: 85°C; Termination: Solder; Number of Contacts: 5; Orientation: Vertical; Number of Circuits: 5; Number of Rows: 1; Package Quantity: 900; Fastening Type: Latch; Packaging: Tape and Reel; Contact Gender: Female; Length: 11.8mm; Pitch: 1.5mm; Depth: 6.35mm; Radiation Hardening: No; REACH SVHC: No SVHC; ComponentLink1URL: https://datasheet.ciiva.com/756/5025840370-sd-756789.pdf?src-supplier=Digi-Key; ComponentLink1Description: https://datasheet.ciiva.com/756/5025840370-sd-756789.pdf?src-supplier=Digi-Key; ComponentLink2URL: https://datasheet.ciiva.com/30117/81825025840570-pcb-receptacles-30117024.pdf?src-supplier=Onlinecomponents.com; ComponentLink2Description: https://datasheet.ciiva.com/30117/81825025840570-pcb-receptacles-30117024.pdf?src-supplier=Onlinecomponents.com; ComponentLink3URL: https://datasheet.ciiva.com/10084/5025840570-pcb-receptacles-10084838.pdf?src-supplier=Avnet; ComponentLink3Description: https://datasheet.ciiva.com/10084/5025840570-pcb-receptacles-10084838.pdf?src-supplier=Avnet; ComponentLink4URL: https://datasheet.ciiva.com/13669/5025840570-pcb-receptacles-179570-13669898.pdf?src-supplier=Mouser; ComponentLink4Description: https://datasheet.ciiva.com/13669/5025840570-pcb-receptacles-179570-13669898.pdf?src-supplier=Mouser; Supplier Part Number 1: WM14463CT-ND
J2 J3 J5 = CON_10x2M_SM_RA: CONN HEADER SMD RIGHT ANGLE 1.5MM PITCH; Manufacturer 1: Molex; Voltage Rating: 100V; Current Rating: 1A; Connector Type: Receptacle,Forked,Center Strip Contact; Number of Positions: 20; Gender: Receptacle; Glow Wire Compliant: Non-compliant; Supplier 1: Digi-Key; Stock 1: 1742; Pricing 1: 1=2.37000, 10=2.14700, 100=1.83990 (USD); RoHS: Yes; Mount: Surface Mount,Through Hole; Housing Material: Resin; Color: Beige; Housing Color: Beige; Contact Material: Copper Alloy,Copper,Tin; Contact Plating: Tin; Min Operating Temperature: -25°C; Max Operating Temperature: 85°C; Number of Rows: 2; Packaging: Tape and Reel; Package Quantity: 550; Fastening Type: Latch; Orientation: Right Angle; Termination: Solder; Number of Contacts: 20; Contact Gender: Female; Number of Circuits: 20; Length: 19.3mm; Pitch: 1.5mm; Row Spacing: 1.5mm; Depth: 9.55mm; Radiation Hardening: No; REACH SVHC: No SVHC; ComponentLink1URL: https://datasheet.ciiva.com/6787/5031482090-sd-6787557.pdf?src-supplier=Digi-Key; ComponentLink1Description: https://datasheet.ciiva.com/6787/5031482090-sd-6787557.pdf?src-supplier=Digi-Key; ComponentLink2URL: https://datasheet.ciiva.com/10076/5031482090-pcb-receptacles-10076785.pdf?src-supplier=Avnet; ComponentLink2Description: https://datasheet.ciiva.com/10076/5031482090-pcb-receptacles-10076785.pdf?src-supplier=Avnet; ComponentLink3URL: https://datasheet.ciiva.com/5153/5031482090-pcb-receptacles-179510-5153198.pdf?src-supplier=Mouser; ComponentLink3Description: https://datasheet.ciiva.com/5153/5031482090-pcb-receptacles-179510-5153198.pdf?src-supplier=Mouser; ComponentLink4URL: https://datasheet.ciiva.com/30082/72715031482090-pcb-receptacles-30082526.pdf?src-supplier=Onlinecomponents.com; ComponentLink4Description: https://datasheet.ciiva.com/30082/72715031482090-pcb-receptacles-30082526.pdf?src-supplier=Onlinecomponents.com; ComponentLink5URL: https://datasheet.ciiva.com/6787/5031482090-sd-6787542.pdf?src-supplier=Digi-Key; ComponentLink5Description: https://datasheet.ciiva.com/6787/5031482090-sd-6787542.pdf?src-supplier=Digi-Key; ComponentLink6URL: https://datasheet.ciiva.com/6787/5031482090-sd-6787548.pdf?src-supplier=Digi-Key; ComponentLink6Description: https://datasheet.ciiva.com/6787/5031482090-sd-6787548.pdf?src-supplier=Digi-Key; Supplier Part Number 1: WM9451CT-ND
J4 J6 = CON_6x2M_SM_RA: CONN HEADER SMD RIGHT ANGLE 1.5MM PITCH; Manufacturer 1: Molex; Number of Circuits: 12; Voltage Rating: 100V; Current Rating: 1A; Connector Type: Receptacle,Center Strip Contact; Gender: Receptacle; Glow Wire Compliant: Non-compliant; Supplier 1: Digi-Key; Stock 1: 276; Pricing 1: 1=1.86000, 10=1.68800, 100=1.44720 (USD); RoHS: Yes; Mount: Surface Mount,Through Hole; Contact Plating: Tin; Contact Material: Copper Alloy,Copper,Tin; Housing Color: Beige; Color: Beige; Housing Material: Resin; Min Operating Temperature: -25°C; Max Operating Temperature: 85°C; Packaging: Tape and Reel; Orientation: Right Angle; Number of Rows: 2; Package Quantity: 550; Fastening Type: Latch; Contact Gender: Female; Number of Positions: 12; Termination: Solder; Number of Contacts: 12; Length: 13.3mm; Pitch: 1.5mm; Depth: 9.55mm; Radiation Hardening: No; REACH SVHC: Unknown; ComponentLink1URL: https://datasheet.ciiva.com/756/5031481090-sd-756828.pdf?src-supplier=Digi-Key; ComponentLink1Description: https://datasheet.ciiva.com/756/5031481090-sd-756828.pdf?src-supplier=Digi-Key; ComponentLink2URL: https://datasheet.ciiva.com/10083/5031481290-pcb-receptacles-10083012.pdf?src-supplier=Avnet; ComponentLink2Description: https://datasheet.ciiva.com/10083/5031481290-pcb-receptacles-10083012.pdf?src-supplier=Avnet; ComponentLink3URL: https://datasheet.ciiva.com/30261/68305031481290-pcb-receptacles-30261716.pdf?src-supplier=Onlinecomponents.com; ComponentLink3Description: https://datasheet.ciiva.com/30261/68305031481290-pcb-receptacles-30261716.pdf?src-supplier=Onlinecomponents.com; ComponentLink4URL: https://datasheet.ciiva.com/5162/5031481290-pcb-receptacles-179578-5162271.pdf?src-supplier=Mouser; ComponentLink4Description: https://datasheet.ciiva.com/5162/5031481290-pcb-receptacles-179578-5162271.pdf?src-supplier=Mouser; ComponentLink5URL: https://datasheet.ciiva.com/14155/503148-eng-tds-14155950.pdf?src-supplier=Distrelec; ComponentLink5Description: https://datasheet.ciiva.com/14155/503148-eng-tds-14155950.pdf?src-supplier=Distrelec; Supplier Part Number 1: WM14476CT-ND
J7 = CON_2M_SM_RA: CONN HEADER SMD RIGHT ANGLE 2MM PITCH; Manufacturer 1: Molex; Connector Type: Receptacle,Forked; Number of Positions: 2; Supplier 1: Digi-Key; Stock 1: 3397; Pricing 1: 1=0.53000, 10=0.49400, 25=0.44440, 50=0.39500, 100=0.37850, 250=0.34556 (USD); RoHS: No; Mount: Surface Mount; Contact Plating: Tin; Insulation Color: Natural; Insulation Material: Resin; Min Operating Temperature: -40°C; Max Operating Temperature: 105°C; Fastening Type: Latch; Packaging: Tape and Reel; Number of Rows: 1; Termination: Solder; Flammability Rating: UL94 V-0; ComponentLink1URL: https://www.molex.com/pdm_docs/as/AS-502439-002-001.pdf?src-supplier=Digi-Key; ComponentLink1Description: https://www.molex.com/pdm_docs/as/AS-502439-002-001.pdf?src-supplier=Digi-Key; Supplier Part Number 1: WM15810CT-ND
J8 = HEADER 4X2: CONN HEADER VERT 8POS 2.54MM; Manufacturer 1: Harwin Inc.; Supplier Part Number 1: 952-2122-ND; Supplier 1: Digi-Key; Mount: Through Hole
R13-R28 = RES_10K_0603: RES SMD 10K OHM 5% 1/10W 0603; Manufacturer: Yageo; MPN: RC0603JR-0710KL; Package: 0603 (1608 Metric); Dimensions: 0.063" L x 0.031" W (1.60mm x 0.80mm); Tolerance: 5%; Supplier Part Number 1: 311-10KGRCT-ND; Supplier 1: Digi-Key

## Sheet MCU.SchDoc: Arm - Microcontroller
size Letter; DrawnBy: P.Onaifo; Organization: UW Robotics; Address1: 200 University Avenue; Address2: Waterloo; Address3: Ontario; Address4: Canada N2L 3G6; SheetNumber: 4; SheetTotal: 9
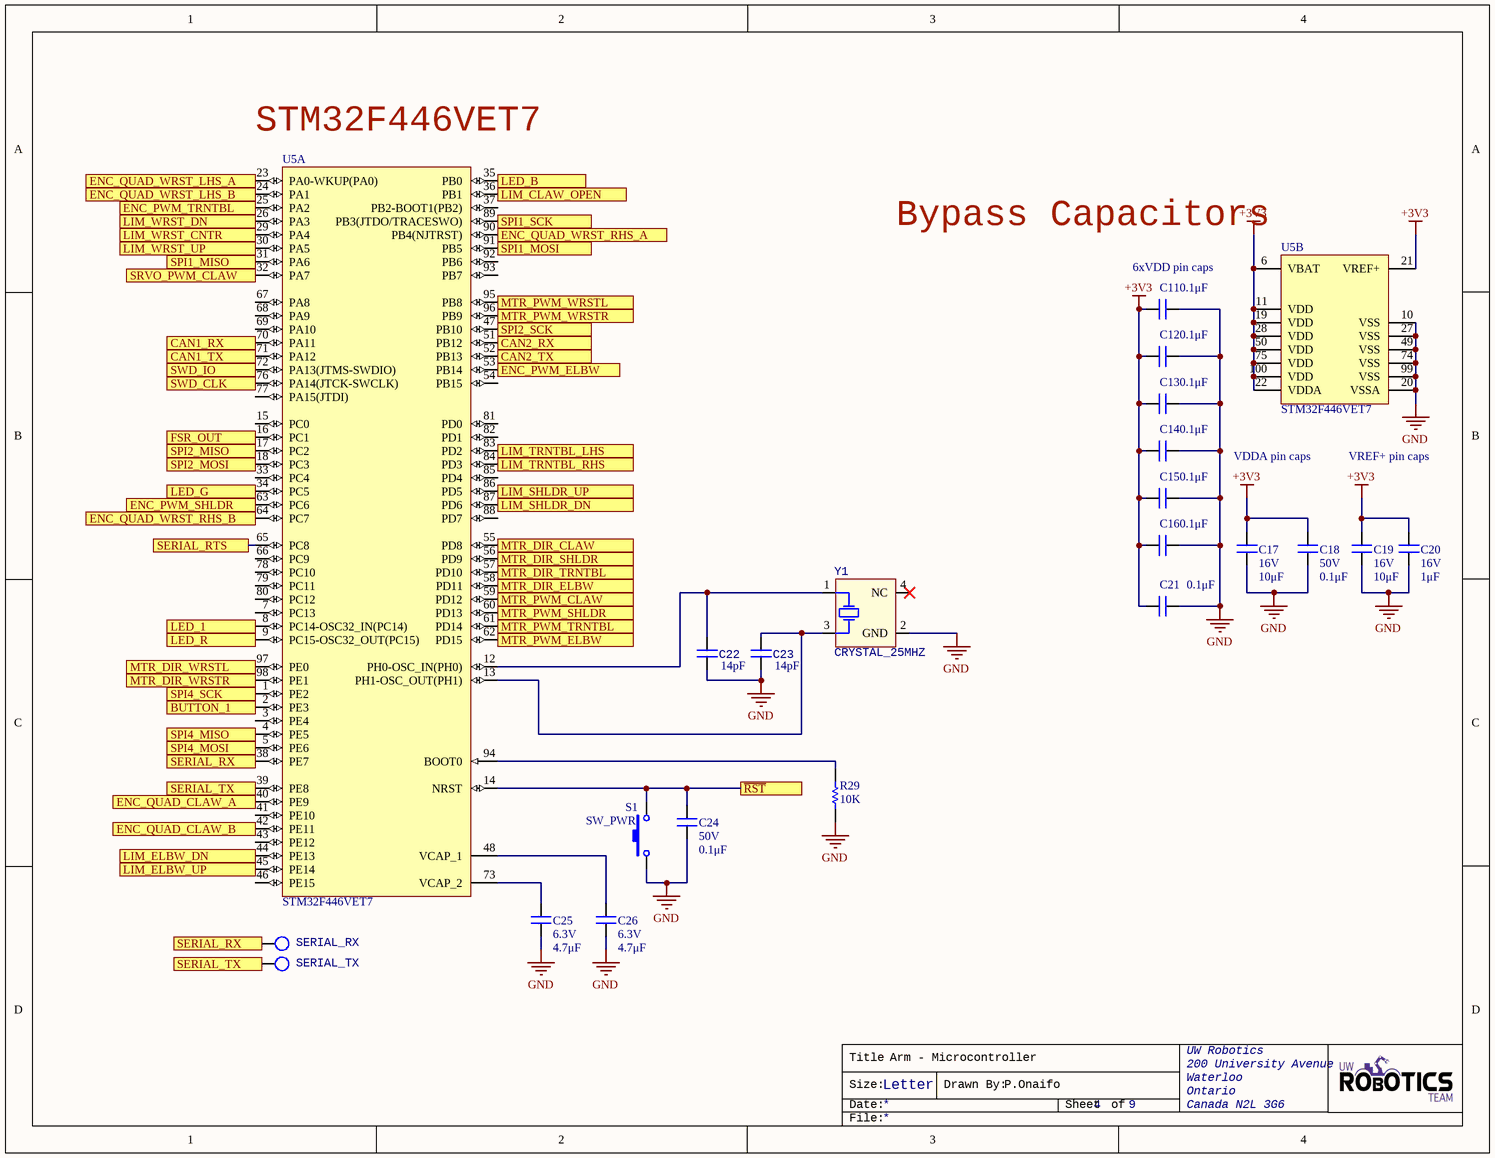
[diagram p4: MCU.SchDoc]

### Parts
C11  value 0.1μF  [CAPC0603(1608)55_N]  (hidden comment: CAP_0.1uF_50V_0603)
C12  value 0.1μF  [CAPC0603(1608)55_N]  (hidden comment: CAP_0.1uF_50V_0603)
C13  value 0.1μF  [CAPC0603(1608)55_N]  (hidden comment: CAP_0.1uF_50V_0603)
C14  value 0.1μF  [CAPC0603(1608)55_N]  (hidden comment: CAP_0.1uF_50V_0603)
C15  value 0.1μF  [CAPC0603(1608)55_N]  (hidden comment: CAP_0.1uF_50V_0603)
C16  value 0.1μF  [CAPC0603(1608)55_N]  (hidden comment: CAP_0.1uF_50V_0603)
C17  value 10μF  Voltage Rating: 16V  [CAPC0603(1608)55_N]  (hidden comment: CAP_10nF_0603)
C18  value 0.1μF  Voltage Rating: 50V  [CAPC0603(1608)55_N]  (hidden comment: CAP_0.1uF_50V_0603)
C19  value 10μF  Voltage Rating: 16V  [CAPC0603(1608)55_N]  (hidden comment: CAP_10nF_0603)
C20  value 1μF  Voltage Rating: 16V  [CAPC0603(1608)55_N]  (hidden comment: CAP_1uF_16V_0603)
C21  value 0.1μF  [CAPC0603(1608)55_N]  (hidden comment: CAP_0.1uF_50V_0603)
C22  value 14pF  (hidden comment: CAP_14pF_50V_0603)
C23  value 14pF  (hidden comment: CAP_14pF_50V_0603)
C24  value 0.1μF  Voltage Rating: 50V  [CAPC0603(1608)55_N]  (hidden comment: CAP_0.1uF_50V_0603)
C25  value 4.7μF  Voltage Rating: 6.3V  [CAPC0603(1608)55_N]  (hidden comment: CAP_4.7uF_0603)
C26  value 4.7μF  Voltage Rating: 6.3V  [CAPC0603(1608)55_N]  (hidden comment: CAP_4.7uF_0603)
R29  value 10K  [RESC0603(1608)_N]  (hidden comment: RES_10K_0603)
S1  SW_PWR  [PTS830GM140]
SERIAL_RX  TESTPOINT_LOOP  [TESTPOINT_LOOP]  (value not drawn)
SERIAL_TX  TESTPOINT_LOOP  [TESTPOINT_LOOP]  (value not drawn)
U5  STM32F446VET7  [STM-LQFP100_L]  (parts A,B of 2)
Y1  CRYSTAL_25MHZ  [SOIC254P1016X440-4N]

### Ports
BUTTON_1, CAN1_RX, CAN1_TX, CAN2_RX, CAN2_TX, ENC_PWM_ELBW, ENC_PWM_SHLDR, ENC_PWM_TRNTBL, ENC_QUAD_CLAW_A, ENC_QUAD_CLAW_B, ENC_QUAD_WRST_LHS_A, ENC_QUAD_WRST_LHS_B, ENC_QUAD_WRST_RHS_A, ENC_QUAD_WRST_RHS_B, FSR_OUT, LED_1, LED_B, LED_G, LED_R, LIM_CLAW_OPEN, LIM_ELBW_DN, LIM_ELBW_UP, LIM_SHLDR_DN, LIM_SHLDR_UP, LIM_TRNTBL_LHS, LIM_TRNTBL_RHS, LIM_WRST_CNTR, LIM_WRST_DN, LIM_WRST_UP, MTR_DIR_CLAW, MTR_DIR_ELBW, MTR_DIR_SHLDR, MTR_DIR_TRNTBL, MTR_DIR_WRSTL, MTR_DIR_WRSTR, MTR_PWM_CLAW, MTR_PWM_ELBW, MTR_PWM_SHLDR, MTR_PWM_TRNTBL, MTR_PWM_WRSTL, MTR_PWM_WRSTR, SERIAL_RTS, SERIAL_RX, SERIAL_TX, SPI1_MISO, SPI1_MOSI, SPI1_SCK, SPI2_MISO, SPI2_MOSI, SPI2_SCK, SPI4_MISO, SPI4_MOSI, SPI4_SCK, SRVO_PWM_CLAW, SWD_CLK, SWD_IO, ~{RST}

### Nets
+3V3: C11.1 C12.1 C13.1 C14.1 C15.1 C16.1 C17.2 C18.2 C19.1 C20.2 C21.1 U5.6(VBAT) U5.11(VDD) U5.19(VDD) U5.21(VREF+) U5.22(VDDA) U5.28(VDD) U5.50(VDD) U5.75(VDD) U5.100(VDD)
GND: C11.2 C12.2 C13.2 C14.2 C15.2 C16.2 C17.1 C18.1 C19.2 C20.1 C21.2 C22.1 C23.1 C24.1 C25.1 C26.1 R29.2 S1.1 U5.10(VSS) U5.20(VSSA) U5.27(VSS) U5.49(VSS) U5.74(VSS) U5.99(VSS) Y1.2(GND)
NetC7_2: U5.16(PC1) ; port FSR_OUT
NetC22_2: C22.2 U5.12(PH0-OSC_IN(PH0)) Y1.1(HOT)
NetC23_2: C23.2 U5.13(PH1-OSC_OUT(PH1)) Y1.3(HOT)
NetC24_2: C24.2 S1.2 U5.14(NRST) ; port ~{RST}
NetC25_2: C25.2 U5.73(VCAP_2)
NetC26_2: C26.2 U5.48(VCAP_1)
NetC29_2: U5.42(PE11) ; port ENC_QUAD_CLAW_B
NetC30_2: U5.24(PA1) ; port ENC_QUAD_WRST_LHS_B
NetC31_2: U5.40(PE9) ; port ENC_QUAD_CLAW_A
NetC32_2: U5.23(PA0-WKUP(PA0)) ; port ENC_QUAD_WRST_LHS_A
NetC33_2: U5.53(PB14) ; port ENC_PWM_ELBW
NetC34_2: U5.90(PB4(NJTRST)) ; port ENC_QUAD_WRST_RHS_A
NetC35_2: U5.63(PC6) ; port ENC_PWM_SHLDR
NetC36_2: U5.64(PC7) ; port ENC_QUAD_WRST_RHS_B
NetC37_2: U5.25(PA2) ; port ENC_PWM_TRNTBL
NetJ1_1: U5.97(PE0) ; port MTR_DIR_WRSTL
NetJ1_2: U5.95(PB8) ; port MTR_PWM_WRSTL
NetJ1_3: U5.98(PE1) ; port MTR_DIR_WRSTR
NetJ1_4: U5.96(PB9) ; port MTR_PWM_WRSTR
NetJ2_5: U5.45(PE14) ; port LIM_ELBW_UP
NetJ2_7: U5.44(PE13) ; port LIM_ELBW_DN
NetJ2_15: U5.36(PB1) ; port LIM_CLAW_OPEN
NetJ3_1: U5.30(PA5) ; port LIM_WRST_UP
NetJ3_3: U5.29(PA4) ; port LIM_WRST_CNTR
NetJ3_5: U5.26(PA3) ; port LIM_WRST_DN
NetJ4_1: U5.62(PD15) ; port MTR_PWM_ELBW
NetJ4_2: U5.61(PD14) ; port MTR_PWM_TRNTBL
NetJ4_3: U5.60(PD13) ; port MTR_PWM_SHLDR
NetJ4_4: U5.59(PD12) ; port MTR_PWM_CLAW
NetJ4_7: U5.58(PD11) ; port MTR_DIR_ELBW
NetJ4_8: U5.57(PD10) ; port MTR_DIR_TRNTBL
NetJ4_9: U5.56(PD9) ; port MTR_DIR_SHLDR
NetJ4_10: U5.55(PD8) ; port MTR_DIR_CLAW
NetJ5_9: U5.87(PD6) ; port LIM_SHLDR_DN
NetJ5_11: U5.86(PD5) ; port LIM_SHLDR_UP
NetJ5_13: U5.84(PD3) ; port LIM_TRNTBL_RHS
NetJ5_15: U5.83(PD2) ; port LIM_TRNTBL_LHS
NetJ8_2: SERIAL_TX.1 U5.39(PE8) ; port SERIAL_TX
NetJ8_3: SERIAL_RX.1 U5.38(PE7) ; port SERIAL_RX
NetJ8_4: U5.65(PC8) ; port SERIAL_RTS
NetJ8_6: U5.72(PA13(JTMS-SWDIO)) ; port SWD_IO
NetJ8_7: U5.76(PA14(JTCK-SWCLK)) ; port SWD_CLK
NetJ9_4: U5.17(PC2) ; port SPI2_MISO
NetJ9_10: U5.4(PE5) ; port SPI4_MISO
NetJ9_16: U5.31(PA6) ; port SPI1_MISO
NetR29_1: R29.1 U5.94(BOOT0)
NetR49_1: U5.8(PC14-OSC32_IN(PC14)) ; port LED_1
NetR50_1: U5.2(PE3) ; port BUTTON_1
NetR51_2: U5.35(PB0) ; port LED_B
NetR52_1: U5.9(PC15-OSC32_OUT(PC15)) ; port LED_R
NetR53_2: U5.34(PC5) ; port LED_G
NetSPI1_MOSI_1: U5.91(PB5) ; port SPI1_MOSI
NetSPI1_SCK_1: U5.89(PB3(JTDO/TRACESWO)) ; port SPI1_SCK
NetSPI2_MOSI_1: U5.18(PC3) ; port SPI2_MOSI
NetSPI2_SCK_1: U5.47(PB10) ; port SPI2_SCK
NetSPI4_MOSI_1: U5.5(PE6) ; port SPI4_MOSI
NetSPI4_SCK_1: U5.1(PE2) ; port SPI4_SCK
NetU1_2: U5.70(PA11) ; port CAN1_RX
NetU1_3: U5.71(PA12) ; port CAN1_TX
NetU2_2: U5.51(PB12) ; port CAN2_RX
NetU2_3: U5.52(PB13) ; port CAN2_TX
NetU5_32: U5.32(PA7) ; port SRVO_PWM_CLAW

Not connected (* = marked no-connect by the designer): U5 3(PE4) 7(PC13) 15(PC0) 33(PC4) 37(PB2-BOOT1(PB2)) 41(PE10) 43(PE12) 46(PE15) 54(PB15) 66(PC9) 67(PA8) 68(PA9) 69(PA10) 77(PA15(JTDI)) 78(PC10) 79(PC11) 80(PC12) 81(PD0) 82(PD1) 85(PD4) 88(PD7) 92(PB6) 93(PB7); Y1 4(NC)*

### Notes on the sheet
- (near U5) STM32F446VET7
- Bypass Capacitors
- (near C11) 6xVDD pin caps
- VDDA pin caps
- VREF+ pin caps
- Title
- Size:
- Date:
- Letter
- Drawn By:
- Sheet
- of
- File:

### Library data of the parts
C11-C16 C18 C21 C24 = CAP_0.1uF_50V_0603: as C3 on sheet CAN; Dimensions: 0.063" L x 0.031" W (1.60mm x 0.80mm); Package: 0603 (1608 Metric); Temperature Coefficient: X7R; Supplier Part Number 1: 311-1344-1-ND; Supplier 1: Digi-Key; Mount: Surface Mount; Case Code (Imperial): 0603; Case Code (Metric): 1608; Dielectric: X7R
  C11-C16 C21: Voltage Rating: 50V
C17 C19 = CAP_10nF_0603: CAP CER 10000PF 16V X7R 0603; Manufacturer Part Number 1: CC0603KRX7R7BB103; Manufacturer 1: Yageo; Dimensions: 0.063" L x 0.031" W (1.60mm x 0.80mm); Package: 0603 (1608 Metric); Temperature Coefficient: X7R; Supplier Part Number 1: 311-3369-1-ND; Supplier 1: Digi-Key; Mount: Surface Mount; Case Code (Imperial): 0603; Case Code (Metric): 1608; Dielectric: X7R
C20 = CAP_1uF_16V_0603: CAP CER 1UF 16V Y5V 0603; Manufacturer Part Number: CC0603ZRY5V7BB105; Manufacturer 1: Yageo; Dimensions: 0.063" L x 0.031" W (1.60mm x 0.80mm); Package: 0603 (1608 Metric); Temperature Coefficient: Y5V; Supplier Part Number 1: 311-1372-1-ND; Supplier 1: Digi-Key; Mount: Surface Mount; Case Code (Imperial): 0603; Case Code (Metric): 1608; Manufacturer Part Number 1: CC0603ZRY5V7BB105; Dielectric: Y5V
C22 C23 = CAP_14pF_50V_0603: CAP CER 14PF 50V C0G/NP0 0603; Manufacturer 1: Samsung; Manufacturer Part Number 1: CL10C140JB8NNNC; Tolerance: 5%; Dielectric: C0G, NP0; Voltage Rating: 50V; Supplier Part Number 1: 1276-2187-1-ND; Supplier 1: Digi-Key; Stock 1: 187088; Pricing 1: 1=0.10000, 10=0.06700, 100=0.02980, 500=0.02130, 1000=0.01673 (USD); RoHS: Yes; Mount: Surface Mount; Case Code (Metric): 1608; Case Code (Imperial): 0603; Min Operating Temperature: -55°C; Max Operating Temperature: 125°C; Package Quantity: 1; Packaging: Tape and Reel; Voltage Rating (DC): 50V; Length: 1.6mm; Height: 0.8mm; Width: 0.031inch; Depth: 0.8mm; Thickness: 0.035inch; Radiation Hardening: No; ComponentLink1URL: https://datasheet.ciiva.com/25782/cl10c140jb8nnnc-25782947.pdf?src-supplier=Digi-Key; ComponentLink1Description: https://datasheet.ciiva.com/25782/cl10c140jb8nnnc-25782947.pdf?src-supplier=Digi-Key; Package: 0603 (1608 Metric)
C25 C26 = CAP_4.7uF_0603: CAP CER 4.7UF 6.3V X5R 0603; Manufacturer Part Number 1: CC0603KRX5R5BB475; Manufacturer 1: Yageo; Dimensions: 0.063" L x 0.031" W (1.60mm x 0.80mm); Package: 0603 (1608 Metric); Temperature Coefficient: X5R; Supplier Part Number 1: 311-1521-1-ND; Supplier 1: Digi-Key; Mount: Surface Mount; Case Code (Imperial): 0603; Case Code (Metric): 1608; Dielectric: X5R
R29 = RES_10K_0603: as R13 on sheet Integrated Connectors; Package: 0603 (1608 Metric); Dimensions: 0.063" L x 0.031" W (1.60mm x 0.80mm); Tolerance: 5%; Supplier Part Number 1: 311-10KGRCT-ND; Supplier 1: Digi-Key
S1 = SW_PWR: Power Switch (Red); pin to pad: 2>4; Manufacturer Part Number 1: PTS830GM140 SMTR LFS; Manufacturer 1: C&K; ComponentLink1Description: Datasheet; ComponentLink1URL: https://www.ckswitches.com/media/1478/pts830.pdf; Supplier Part Number 1: CKN10587CT-ND; Supplier 1: Digi-Key; Mount: Surface Mount
SERIAL_RX SERIAL_TX = TESTPOINT_LOOP: as CAN1_N on sheet CAN; Supplier Part Number 1: 36-5002-ND; Supplier 1: Digi-Key; Mount: Through Hole
U5 = CMP-0243-00221-1: ARM Cortex-M4 32-bit MCU+FPU, 512 KB Flash, 128 KB Internal RAM, 81 I/Os, 100-Pin LQFP, -40 to 105 degC, Tray; Supply Voltage(Vcc) min (V): 1.7; Operating Frequency(F) (Processor speed) (MHz): 180; D/A Converter: 2; FLASH Size (Prog) (kB): 512; I/Os (High Current): 81; Internal RAM Size (kB): 128; Core: ARM Cortex-M4; Packing: Tray; ComponentLink1URL: http://www.st.com/; DatasheetVersion: Rev. 6; Mounting Technology: Surface Mount; ComponentLink2Description: Datasheet; ComponentLink2URL: http://www.st.com/st-web-ui/static/active/en/resource/technical/document/datasheet/DM00141306.pdf; Package Reference: 100-Pin Low Profile Quad Flat Package, Body 14 x 14 mm, Pitch 0.5 mm; ComponentLink1Description: Manufacturer URL; Package Description: LQFP100
Y1 = CRYSTAL_25MHZ: CRYSTAL 25.0000MHZ 12PF SMD; Manufacturer 1: Kyocera AVX; Manufacturer Part Number 1: CX2520DB25000H0FLJC1; Frequency: 25MHz; ESR (Equivalent Series Resistance): 80R; Frequency Stability: 15ppm; Frequency Tolerance: 10ppm; ComponentLink1Description: https://media.digikey.com/pdf/Data%20Sheets/AVX%20PDFs/CX2520DB_USY1M-H1-16429-00_Spec.pdf?src-supplier=Digi-Key; ComponentLink1URL: https://media.digikey.com/pdf/Data%20Sheets/AVX%20PDFs/CX2520DB_USY1M-H1-16429-00_Spec.pdf?src-supplier=Digi-Key; Supplier 1: Digi-Key; Supplier Part Number 1: 1253-1724-1-ND; Stock 1: 11741; Pricing 1: 1=0.72000, 10=0.63300, 50=0.59120, 100=0.52250, 500=0.49500, 1000=0.41250 (USD); RoHS: Yes; Mount: Surface Mount; Case/Package: SMD/SMT; Min Operating Temperature: -30°C; Max Operating Temperature: 85°C; Packaging: Tape and Reel; Load Capacitance: 12pF; Length: 0.098inch; Height: 0.022inch; Width: 0.079inch; Ratings: AEC-Q200